# Altium schematic sheet PX4FMUv2.4.6_11.SchDoc: PX4FMUv2.4.6.sch
size 282 x 200 mm; Date: 2015/3/26 21:06:24; SheetNumber: Sheet:
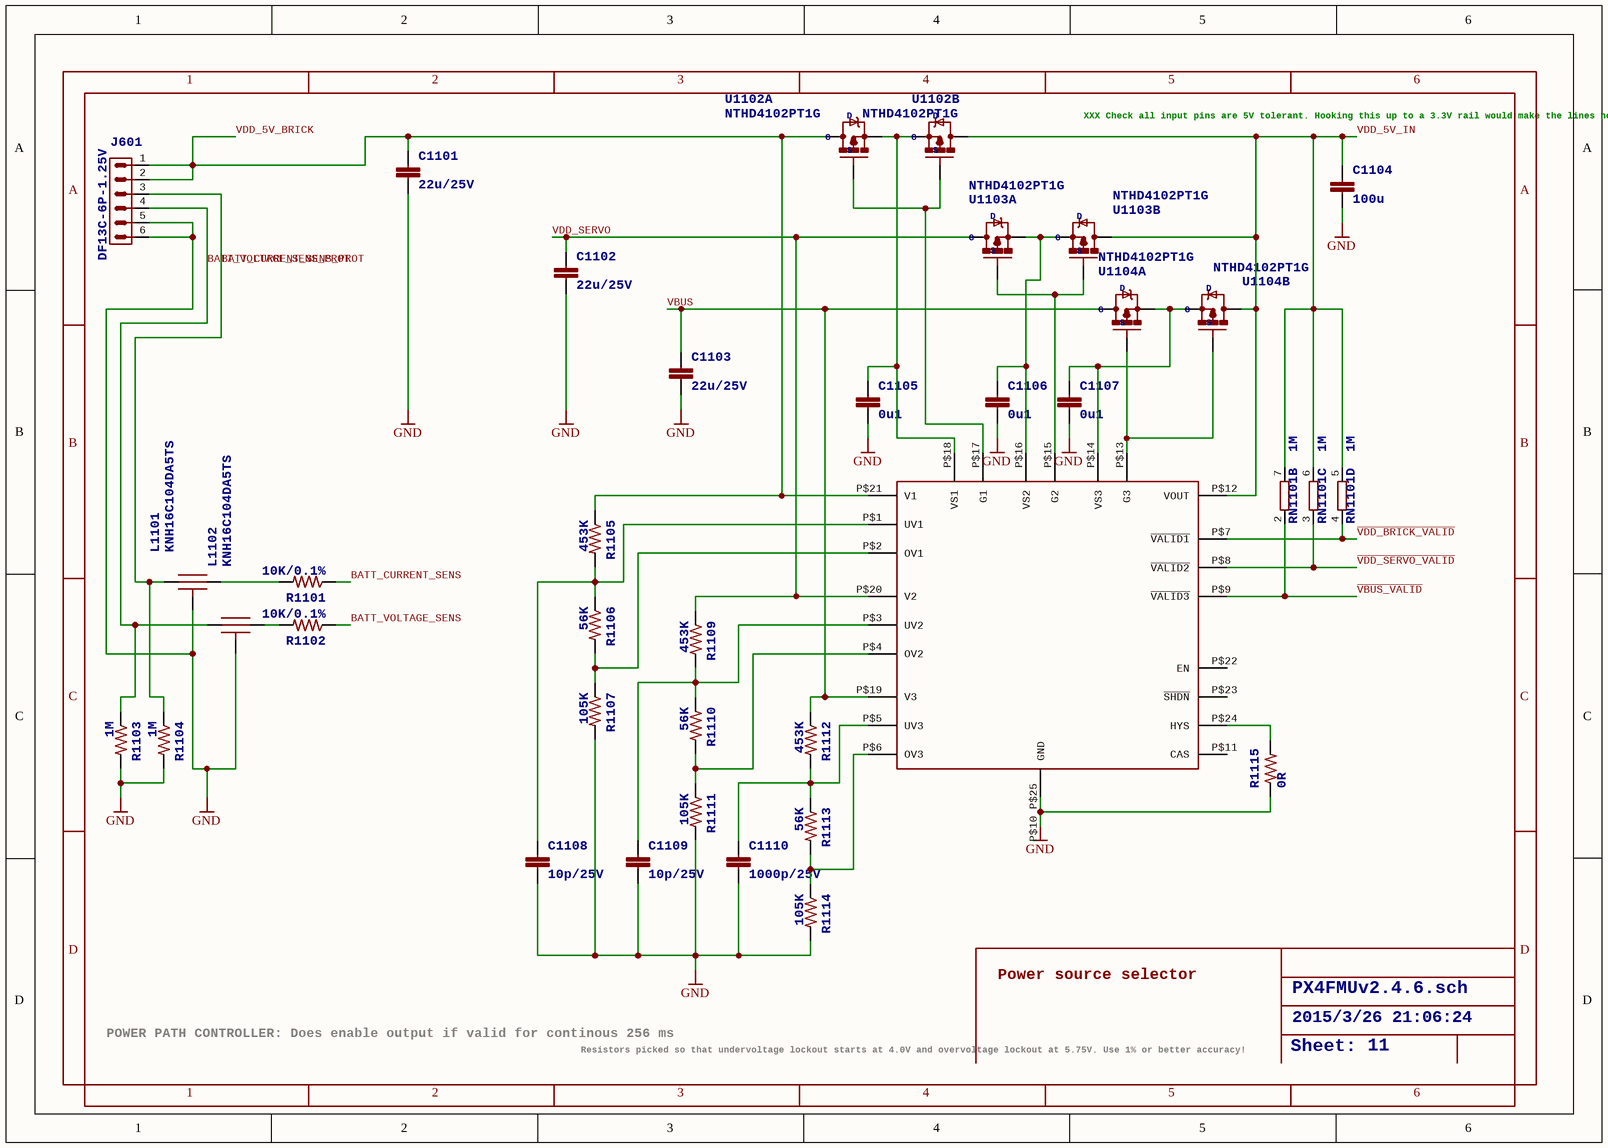
[diagram p0: PX4FMUv2.4.6_11.SchDoc]

## Parts
C1101  22u/25V  [0805-CAP]
C1102  22u/25V  [0805-CAP]
C1103  22u/25V  [0805-CAP]
C1104  100u  [1206-CAP]
C1105  0u1  [0402-CAP]
C1106  0u1  [0402-CAP]
C1107  0u1  [0402-CAP]
C1108  10p/25V  [0402-CAP]
C1109  10p/25V  [0402-CAP]
C1110  1000p/25V  [0402-CAP]
J601  DF13C-6P-1.25V  [DF13C-6P-1.25V]
L1101  KNH16C104DA5TS  [KYOCERA-KNH16-DA]
L1102  KNH16C104DA5TS  [KYOCERA-KNH16-DA]
R1101  10K/0.1%  [0402-RES]
R1102  10K/0.1%  [0402-RES]
R1103  1M  [0402-RES]
R1104  1M  [0402-RES]
R1105  453K  [0402-RES]
R1106  56K  [0402-RES]
R1107  105K  [0402-RES]
R1109  453K  [0402-RES]
R1110  56K  [0402-RES]
R1111  105K  [0402-RES]
R1112  453K  [0402-RES]
R1113  56K  [0402-RES]
R1114  105K  [0402-RES]
R1115  0R  [0402-RES]
RN1101  1M  [EXB28V]  (parts B,C,D of 4)
U1101  LTC4417  [MO-220]  (value not drawn)
U1102  NTHD4102PT1G  [1206-8]  (parts A,B of 2)
U1103  NTHD4102PT1G  [1206-8]  (parts A,B of 2)
U1104  NTHD4102PT1G  [1206-8]  (parts A,B of 2)

## Nets
GND: C1101.P$2 C1102.P$2 C1103.P$2 C1104.P$2 C1105.P$2 C1106.P$2 C1107.P$2 C1108.P$2 C1109.P$2 C1110.P$2 J601.5 J601.6 L1101.P$3_P$4_P$5(P$3) L1102.P$3_P$4_P$5(P$3) R1103.P$2 R1104.P$2 R1107.P$2 R1111.P$2 R1114.P$2 R1115.P$1 U1101.P$10_P$25(GND)
BATT_CURRENT_SENS: R1101.P$1
BATT_CURRENT_SENS_PROT: J601.3 L1101.P$1 R1104.P$1
BATT_VOLTAGE_SENS: R1102.P$1
BATT_VOLTAGE_SENS_PROT: J601.4 L1102.P$1 R1103.P$1
~{VBUS_VALID}: RN1101.2 U1101.P$9(~{VALID3})
~{VDD_BRICK_VALID}: RN1101.4 U1101.P$7(~{VALID1})
~{VDD_SERVO_VALID}: RN1101.3 U1101.P$8(~{VALID2})
VBUS: C1103.P$1 R1112.P$1 U1101.P$19(V3) U1104.P$7_P$8(D)
VDD_5V_BRICK: C1101.P$1 J601.1 J601.2 R1105.P$1 U1101.P$21(V1) U1102.P$7_P$8(D)
VDD_5V_IN: C1104.P$1 RN1101.5 RN1101.6 RN1101.7 U1101.P$12(VOUT) U1102.P$5_P$6(D) U1103.P$5_P$6(D) U1104.P$5_P$6(D)
VDD_SERVO: C1102.P$1 R1109.P$1 U1101.P$20(V2) U1103.P$7_P$8(D)
NetC1105_P$1: C1105.P$1 U1101.P$18(VS1) U1102.P$1(S) U1102.P$3(S)
NetC1106_P$1: C1106.P$1 U1101.P$16(VS2) U1103.P$1(S) U1103.P$3(S)
NetC1107_P$1: C1107.P$1 U1101.P$14(VS3) U1104.P$1(S) U1104.P$3(S)
NetC1108_P$1: C1108.P$1 R1105.P$2 R1106.P$1 U1101.P$1(UV1)
NetC1109_P$1: C1109.P$1 R1109.P$2 R1110.P$1 U1101.P$3(UV2)
NetC1110_P$1: C1110.P$1 R1112.P$2 R1113.P$1 U1101.P$5(UV3)
NetL1101_P$2: L1101.P$2 R1101.P$2
NetL1102_P$2: L1102.P$2 R1102.P$2
NetR1106_P$2: R1106.P$2 R1107.P$1 U1101.P$2(OV1)
NetR1110_P$2: R1110.P$2 R1111.P$1 U1101.P$4(OV2)
NetR1113_P$2: R1113.P$2 R1114.P$1 U1101.P$6(OV3)
NetR1115_P$2: R1115.P$2 U1101.P$24(HYS)
NetU1101_P$13: U1101.P$13(G3) U1104.P$2(G) U1104.P$4(G)
NetU1101_P$15: U1101.P$15(G2) U1103.P$2(G) U1103.P$4(G)
NetU1101_P$17: U1101.P$17(G1) U1102.P$2(G) U1102.P$4(G)

Not connected (* = marked no-connect by the designer): U1101 P$11(CAS) P$22(EN) P$23(~{SHDN})

## Notes on the sheet
- XXX Check all input pins are 5V tolerant.
  Hooking this up to a 3.3V rail
  would make the lines non-readable during power-up sequencing
- Power source selector
- POWER PATH CONTROLLER:
  Does enable output if valid for continous 256 ms
- Resistors picked so that undervoltage lockout starts at 4.0V
  and overvoltage lockout at 5.75V.
  Use 1% or better accuracy!
- 1
- 2
- 3
- 4
- 5
- 6
- A
- B
- C
- D

## Library data of the parts
C1101-C1103 = CAP0805: <b>Capacitor</b> / Standard 0603 ceramic capacitor, and 0.1" leaded capacitor.; PARTNO: CL21A226MAQNNNE
C1104 = CAP1206: <b>Capacitor</b> / Standard 0603 ceramic capacitor, and 0.1" leaded capacitor.; PARTNO: C3216X5R1A107M160AC
C1105-C1107 = CAP0402: <b>Capacitor</b> / Standard 0603 ceramic capacitor, and 0.1" leaded capacitor.; PARTNO: C1005X7R1E104K050BB
C1108 C1109 = CAP0402: <b>Capacitor</b> / Standard 0603 ceramic capacitor, and 0.1" leaded capacitor.; PARTNO: C0402C100J3GACTU
C1110 = CAP0402: <b>Capacitor</b> / Standard 0603 ceramic capacitor, and 0.1" leaded capacitor.; PARTNO: GRM1555C1E102JA01D
J601 = DF13-6P-1.25V: DF13-6P / 1.25mm Pitch Miniature Crimping Connector.
L1101 L1102 = KNH16C104DA5TS: Kyocera KNH16C104DA5TS EMI filter
R1101 R1102 = RESISTOR0402-RES: <b>Resistor</b> / Basic schematic elements and footprints for 0603, 1206, and PTH 1/10th watt (small) resistors.; PARTNO: ERA-2AEB103X
R1103 R1104 = RESISTOR0402-RES: <b>Resistor</b> / Basic schematic elements and footprints for 0603, 1206, and PTH 1/10th watt (small) resistors.; PARTNO: RC0402FR-071ML
R1105 R1109 R1112 = RESISTOR0402-RES: <b>Resistor</b> / Basic schematic elements and footprints for 0603, 1206, and PTH 1/10th watt (small) resistors.; PARTNO: RMCF0402FT453K
R1106 R1110 R1113 = RESISTOR0402-RES: <b>Resistor</b> / Basic schematic elements and footprints for 0603, 1206, and PTH 1/10th watt (small) resistors.; PARTNO: ERA-2AEB563X
R1107 R1111 R1114 = RESISTOR0402-RES: <b>Resistor</b> / Basic schematic elements and footprints for 0603, 1206, and PTH 1/10th watt (small) resistors.; PARTNO: ERJ-2RKF1053X
R1115 = RESISTOR0402-RES: <b>Resistor</b> / Basic schematic elements and footprints for 0603, 1206, and PTH 1/10th watt (small) resistors.; PARTNO: ERJ-2GE0R00X
RN1101 = 4R-NEXB28V: <b>Array Chip Resistor</b><p> / Source: RS Component / Phycomp; PARTNO: EXB-28V105JX; OC_FARNELL: unknown; OC_NEWARK: unknown
U1101 = LTC4117: PARTNO: LTC4417IUF#PBF
U1102-U1104 = MOSFET-DUAL-PCHANNEL-CHIPFET: PARTNO: NTHD4102PT1G; D: D; S: S; G: G